# EAGLE design Mainboard (EAGLE 5.12)
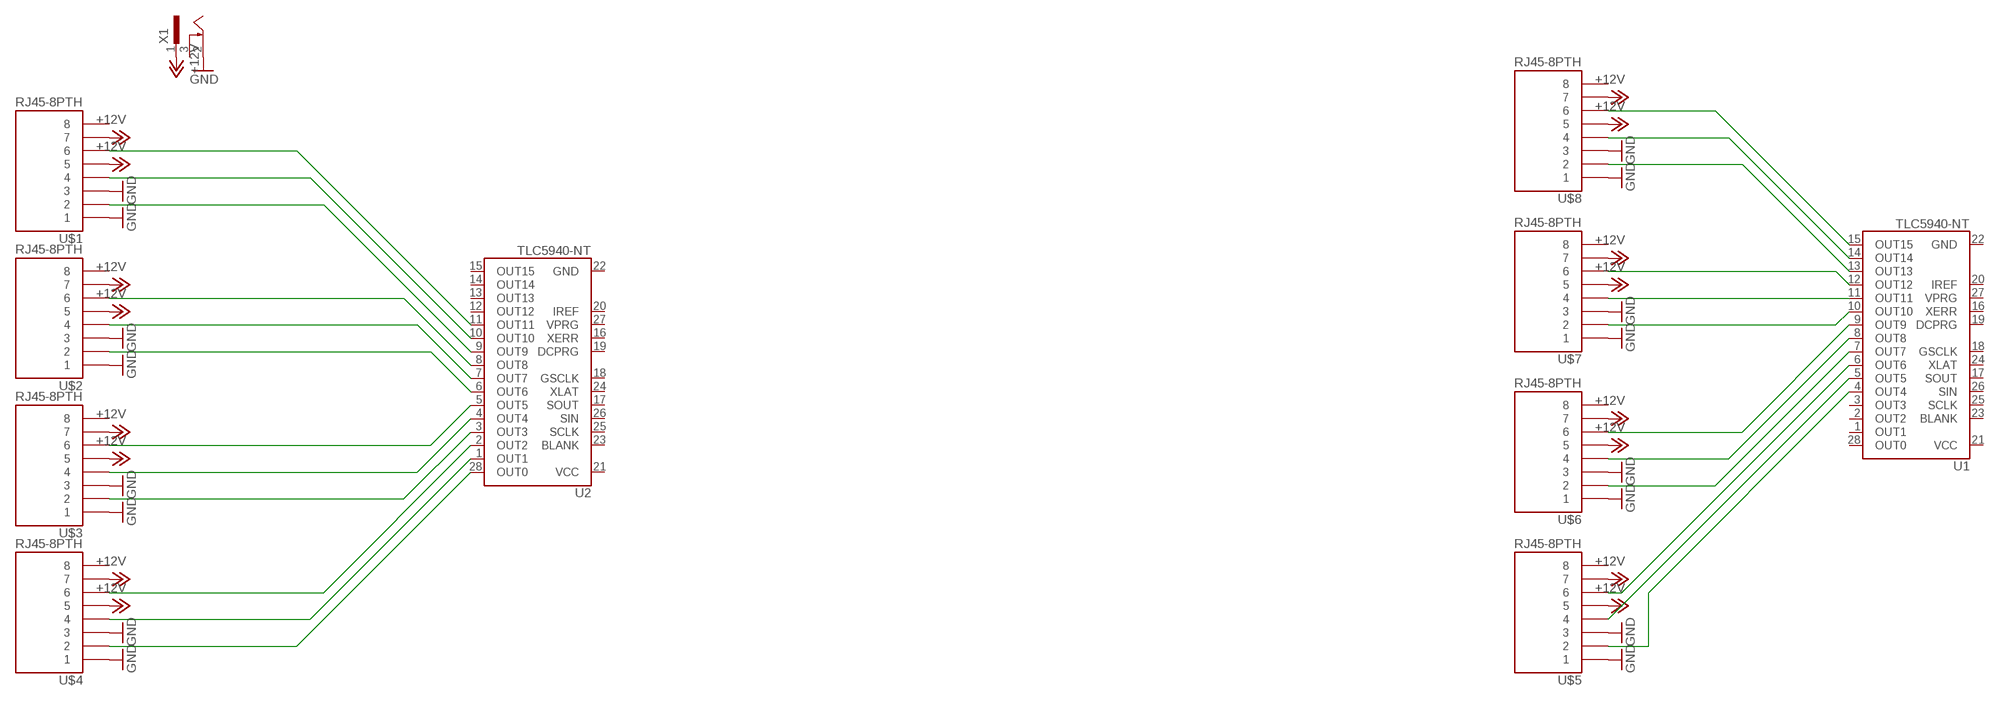
[diagram p0: schematic, sheet 1]

## Parts
U1  TLC5940-NT  [DIL28-3]
U2  TLC5940-NT  [DIL28-3]
U$1  RJ45-8PTH  [RJ45-8]
U$2  RJ45-8PTH  [RJ45-8]
U$3  RJ45-8PTH  [RJ45-8]
U$4  RJ45-8PTH  [RJ45-8]
U$5  RJ45-8PTH  [RJ45-8]
U$6  RJ45-8PTH  [RJ45-8]
U$7  RJ45-8PTH  [RJ45-8]
U$8  RJ45-8PTH  [RJ45-8]
X1  SCD-014A  [SCD-014-A]

## Nets
+12V: U$1.5 U$1.7 U$2.5 U$2.7 U$3.5 U$3.7 U$4.5 U$4.7 U$5.5 U$5.7 U$6.5 U$6.7 U$7.5 U$7.7 U$8.5 U$8.7 X1.1
GND: U$1.1 U$1.3 U$2.1 U$2.3 U$3.1 U$3.3 U$4.1 U$4.3 U$5.1 U$5.3 U$6.1 U$6.3 U$7.1 U$7.3 U$8.1 U$8.3 X1.2
N$1: U1.15(OUT15) U$8.6
N$2: U1.14(OUT14) U$8.4
N$3: U1.13(OUT13) U$8.2
N$4: U1.12(OUT12) U$7.6
N$5: U1.11(OUT11) U$7.4
N$6: U1.10(OUT10) U$7.2
N$7: U1.9(OUT9) U$6.6
N$8: U1.8(OUT8) U$6.4
N$9: U1.7(OUT7) U$6.2
N$10: U1.6(OUT6) U$5.6
N$11: U1.5(OUT5) U$5.4
N$12: U1.4(OUT4) U$5.2
N$13: U2.28(OUT0) U$4.2
N$14: U2.1(OUT1) U$4.4
N$15: U2.2(OUT2) U$4.6
N$16: U2.3(OUT3) U$3.2
N$17: U2.4(OUT4) U$3.4
N$18: U2.5(OUT5) U$3.6
N$19: U2.6(OUT6) U$2.2
N$20: U2.7(OUT7) U$2.4
N$21: U2.8(OUT8) U$2.6
N$22: U2.9(OUT9) U$1.2
N$23: U2.10(OUT10) U$1.4
N$24: U2.11(OUT11) U$1.6
Unconnected: U1.1(OUT1) U1.2(OUT2) U1.3(OUT3) U1.16(XERR) U1.17(SOUT) U1.18(GSCLK) U1.19(DCPRG) U1.20(IREF) U1.21(VCC) U1.22(GND) U1.23(BLANK) U1.24(XLAT) U1.25(SCLK) U1.26(SIN) U1.27(VPRG) U1.28(OUT0) U2.12(OUT12) U2.13(OUT13) U2.14(OUT14) U2.15(OUT15) U2.16(XERR) U2.17(SOUT) U2.18(GSCLK) U2.19(DCPRG) U2.20(IREF) U2.21(VCC) U2.22(GND) U2.23(BLANK) U2.24(XLAT) U2.25(SCLK) U2.26(SIN) U2.27(VPRG) U$1.8 U$2.8 U$3.8 U$4.8 U$5.8 U$6.8 U$7.8 U$8.8 X1.3

## Library data of the parts
U1 U2 = SparkFun:TLC5940: TI TLC5940 16-channel LED Driver with Dot Correction and Grayscale PWM Control The TLC5940 is a 16-channel, constant-current sink LED driver. Each channel has an individually adjustable 4096-step grayscale PWM brightness control and a 64-step, constant-current sink (dot correction). The dot correction adjusts the brightness variations between LED channels and other LED drivers. The dot correction data is stored in an integrated EEPROM. Both grayscale control and dot correction are accessible via a serial interface. A single external resistor sets the maximum current value of all 16 channels. Packages: 28-pin HTSSOP 32-pin 5x5mm QFN 28-pin DIP
U$1-U$8 = SparkFun:RJ45-8: RJ45 Jack Simple RJ45, 8-pin connection - connector for common Cat5, Cat5e, and Cat6 Ethernet cables. Footprint not yet proven in production. Connector sku is PRT-00643; Breakout PCB sku is BOB-00716.
X1 = con-shiua-chyuan:SCD-014A: Power Jack 2.5mm; OC_FARNELL: unknown; OC_NEWARK: unknown

## Board
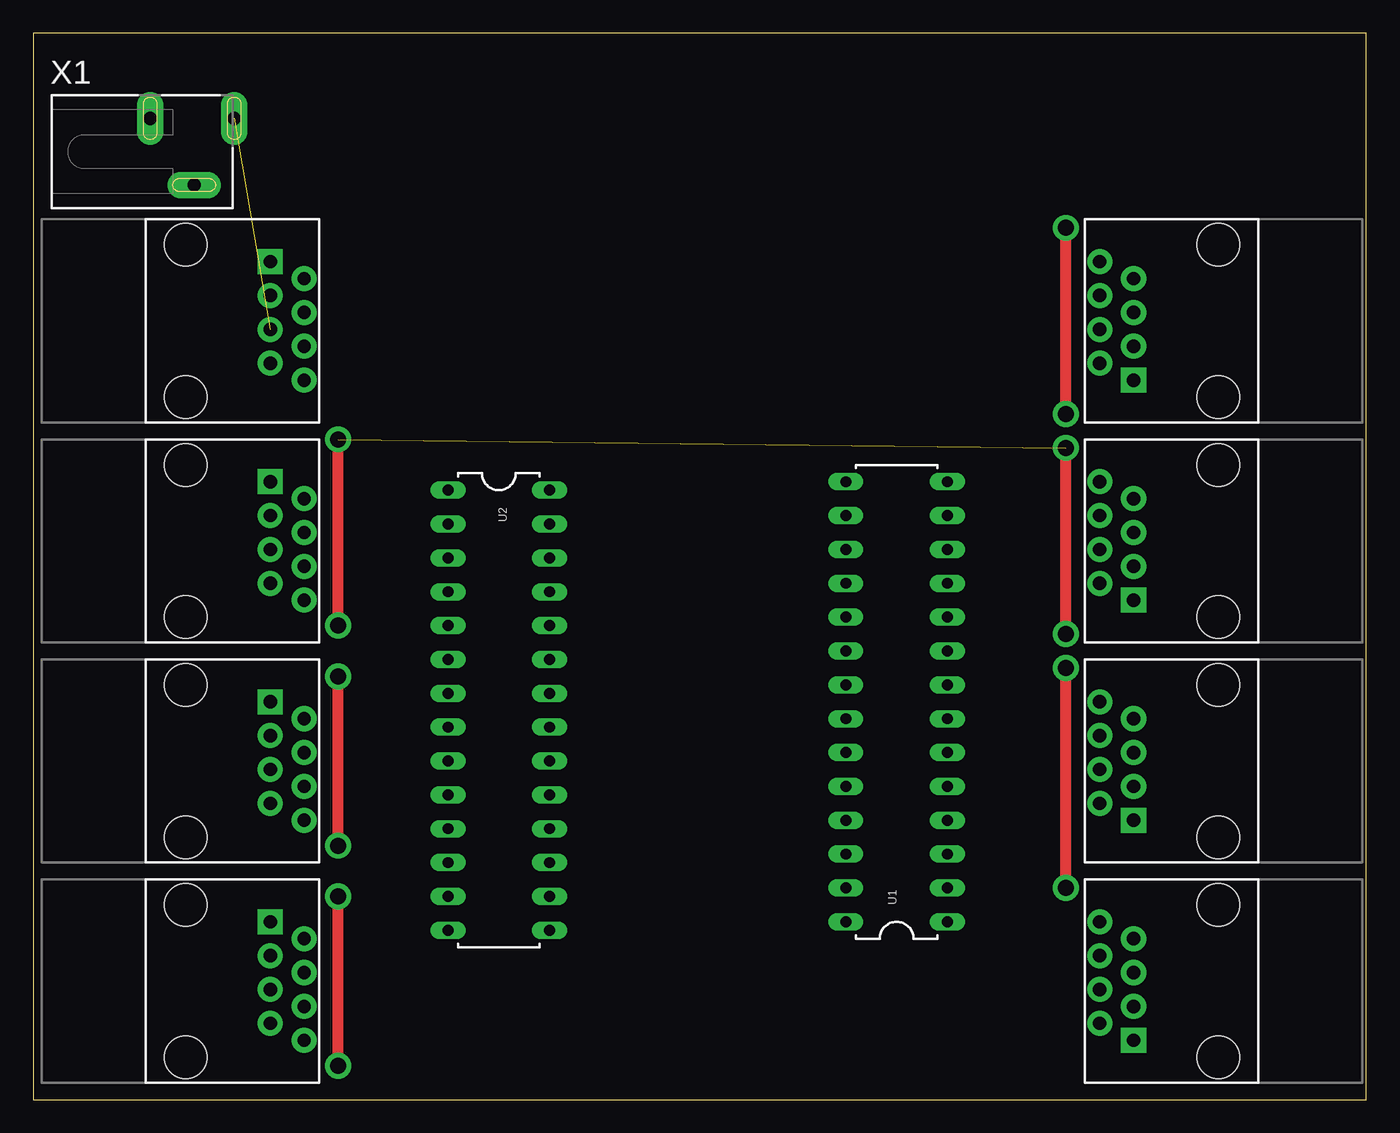
[diagram p1: board, top side]
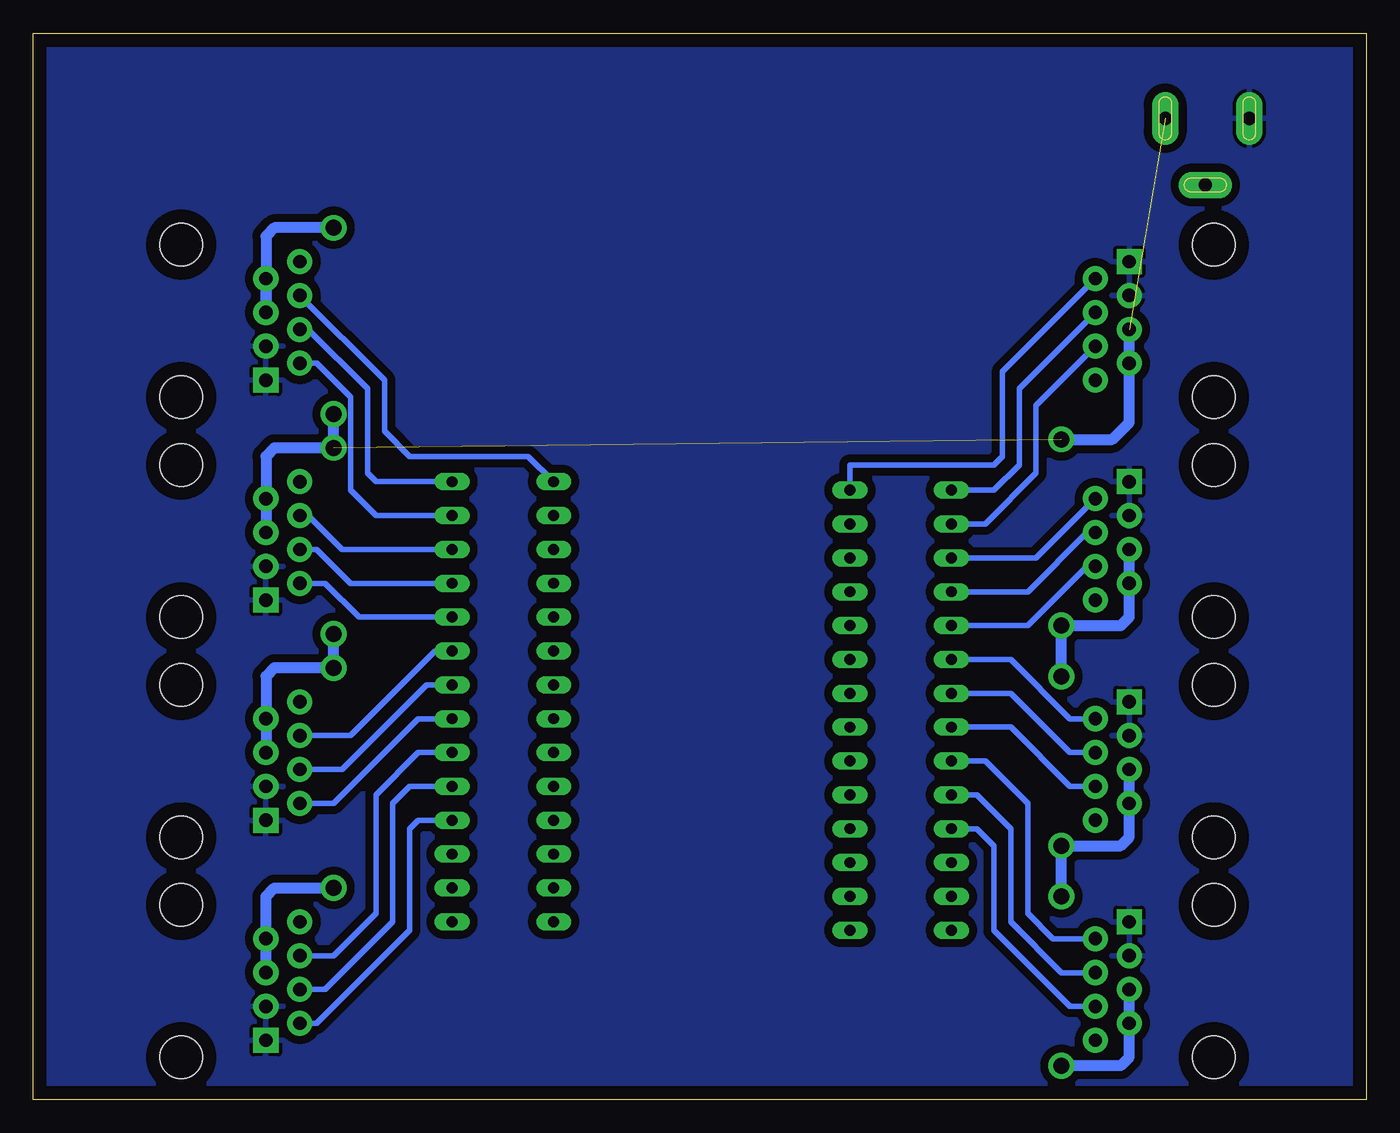
[diagram p2: board, bottom side, seen from below]

Size 100 x 80 mm. Coordinates in mm from the lower left corner, seen from the top.
Outline: 0,0 100,0 100,80 0,80 0,0
Copper layers (1*16): Top 0.035mm / dielectric 1.5mm / Bottom 0.035mm
Design rules "default": minimum track width 10mil, minimum drill 0.6mm, track to track 8mil, track to pad 8mil, pad to pad 8mil, via to via 8mil, smd to smd 8mil, copper to edge 40mil, drill to drill 8mil, minimum pad ring 10mil, minimum via ring 8mil, stop-mask expansion 4mil, vias tented up to drill 0mil, thermal gap 10mil

### Footprints (pad centres in the part's own frame; a part is rotated, then mirrored left to right if it is on the bottom)
DIL28-3 = drill 0.813 long: 1 -16.51,-3.81; 2 -13.97,-3.81; 3 -11.43,-3.81; 4 -8.89,-3.81; 5 -6.35,-3.81; 6 -3.81,-3.81; 7 -1.27,-3.81; 8 1.27,-3.81; 9 3.81,-3.81; 10 6.35,-3.81; 11 8.89,-3.81; 12 11.43,-3.81; 13 13.97,-3.81; 14 16.51,-3.81; 15 16.51,3.81; 16 13.97,3.81; 17 11.43,3.81; 18 8.89,3.81; 19 6.35,3.81; 20 3.81,3.81; 21 1.27,3.81; 22 -1.27,3.81; 23 -3.81,3.81; 24 -6.35,3.81; 25 -8.89,3.81; 26 -11.43,3.81; 27 -13.97,3.81; 28 -16.51,3.81
RJ45-8 = drill 1 pad 1.88 square: 1 -4.445,6.35 | drill 1 pad 1.88 round: 2 -3.175,8.89; 3 -1.905,6.35; 4 -0.635,8.89; 5 0.635,6.35; 6 1.905,8.89; 7 3.175,6.35; 8 4.445,8.89 | hole 3.2: -5.715,0; 5.715,0
SCD-014-A = drill 1 pad 2 long: 1 -2.5,13.8; 2 -2.5,7.5; 3 2.5,10.8

### Placement (x,y rotation side)
U1  64.77,29.84 90 top
U2  34.92,29.21 270 top
U$1  11.43,8.89 270 top
U$2  11.43,25.4 270 top
U$3  11.43,41.91 270 top
U$4  11.43,58.42 270 top
U$5  88.9,8.89 90 top
U$6  88.9,25.4 90 top
U$7  88.9,41.91 90 top
U$8  88.9,58.42 90 top
X1  1.27,71.12 270 top

### Tracks (layer width: path | path; a pad name or v marks a point on that pad's centre or on a via)
+12V  (via drill 1.2 pad 1.93)  (2 unrouted)
  Top 0.813: v22.86,35.56 v22.86,49.53 | v22.86,19.05 v22.86,31.75 | v22.86,2.54 v22.86,15.24 | v77.47,51.44 v77.47,65.41 | v77.47,34.92 v77.47,48.9 | v77.47,15.88 v77.47,32.38
  Bottom 0.813: U$3.5 U$3.7 17.78,36.2 18.41,35.56 v22.86,35.56 v22.86,31.75 | 22.23,19.05 v22.86,19.05 | U$2.5 U$2.7 17.78,19.68 18.41,19.05 22.23,19.05 | 22.23,19.05 22.86,18.41 v22.86,15.24 | v22.86,2.54 18.41,2.54 17.78,3.17 U$1.7 U$1.5 | U$8.7 U$8.5 82.55,64.77 81.92,65.41 v77.47,65.41 | v77.47,51.44 v77.47,48.9 81.92,48.9 82.55,48.26 U$7.7 U$7.5 | v77.47,34.92 v77.47,32.38 81.92,32.38 82.55,31.75 U$6.7 U$6.5 | v77.47,15.88 81.92,15.88 82.55,15.24 U$5.7 U$5.5 | U$4.5 U$4.7 17.78,50.8 19.05,49.53 v22.86,49.53
GND
  pour Bottom (isolate 0.61): -3.81,82.55 104.14,82.55 104.14,-3.81 -3.81,-3.81
N$1
  Bottom 0.406: U$8.6 73.66,53.98 73.66,50.16 71.75,48.26 62.87,48.26 U1.15
N$2
  Bottom 0.406: U$8.4 79.38,57.78 74.93,53.34 74.93,46.99 74.3,46.35 U1.14
N$3
  Bottom 0.406: U$8.2 78.74,55.24 76.2,52.7 76.2,45.72 74.3,43.81 U1.13
N$4
  Bottom 0.406: U$7.6 79.38,43.81 76.83,41.27 U1.12
N$5
  Bottom 0.406: U$7.4 78.74,41.27 76.2,38.73 U1.11
N$6
  Bottom 0.406: U$7.2 78.11,38.73 75.56,36.2 U1.10
N$7
  Bottom 0.406: U$6.6 76.2,27.3 69.85,33.66 U1.9
N$8
  Bottom 0.406: U$6.4 76.83,24.77 70.48,31.11 U1.8
N$9
  Bottom 0.406: U$6.2 77.47,22.23 71.12,28.57 U1.7
N$10
  Bottom 0.406: U$5.6 77.47,10.79 74.3,13.97 74.3,22.86 71.12,26.04 U1.6
N$11
  Bottom 0.406: U$5.4 78.11,8.26 73.03,13.34 73.03,22.23 71.75,23.5 U1.5
N$12
  Bottom 0.406: U$5.2 78.74,5.71 71.75,12.7 71.75,20.32 71.12,20.95 U1.4
N$13
  Bottom 0.406: U$4.2 27.3,54.61 27.3,48.26 27.94,47.62 38.73,47.62 U2.28
N$14
  Bottom 0.406: U$4.4 26.04,53.34 26.04,47.62 27.94,45.72 U2.1
N$15
  Bottom 0.406: U$4.6 24.77,52.07 24.77,46.99 28.57,43.18 U2.2
N$16
  Bottom 0.406: U$3.2 24.77,40.64 U2.3
N$17
  Bottom 0.406: U$3.4 20.95,42.55 25.4,38.1 U2.4
N$18
  Bottom 0.406: U$3.6 20.95,40.01 25.4,35.56 U2.5
N$19
  Bottom 0.406: U$2.2 22.23,28.57 26.67,33.02 U2.6
N$20
  Bottom 0.406: U$2.4 22.23,26.04 26.67,30.48 U2.7
N$21
  Bottom 0.406: U$2.6 22.23,23.5 26.67,27.94 U2.8
N$22
  Bottom 0.406: U$1.2 23.5,12.06 25.4,13.97 25.4,22.23 28.57,25.4 U2.9
N$23
  Bottom 0.406: U$1.4 22.86,9.53 26.67,13.34 26.67,20.32 29.21,22.86 U2.10
N$24
  Bottom 0.406: U$1.6 22.23,6.99 27.94,12.7 27.94,19.05 29.21,20.32 U2.11